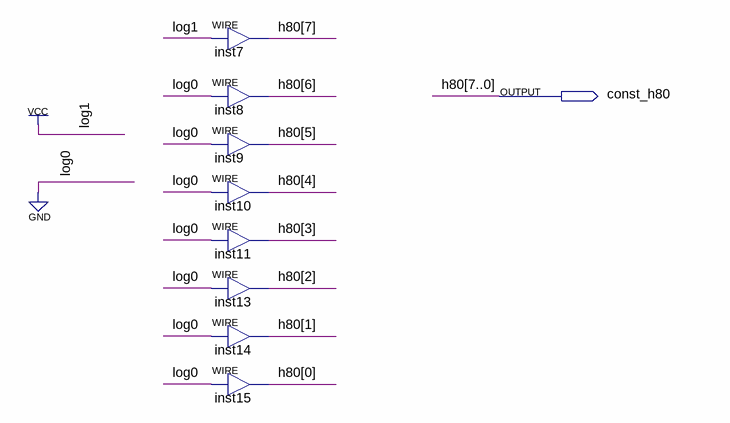
[diagram p0: schematic sheet]
// Quartus schematic C_h80.bdf as structural Verilog: 8 symbols, 1 pins
module C_h80 (
  output const_h80
);

  wire [7:0] h80;

  assign h80[7] = 1'b1;  // WIRE inst7
  assign h80[6] = 1'b0;  // WIRE inst8
  assign h80[5] = 1'b0;  // WIRE inst9
  assign h80[4] = 1'b0;  // WIRE inst10
  assign h80[3] = 1'b0;  // WIRE inst11
  assign h80[2] = 1'b0;  // WIRE inst13
  assign h80[1] = 1'b0;  // WIRE inst14
  assign h80[0] = 1'b0;  // WIRE inst15
endmodule
